# EAGLE design SSD1306 (EAGLE 9.6.2)
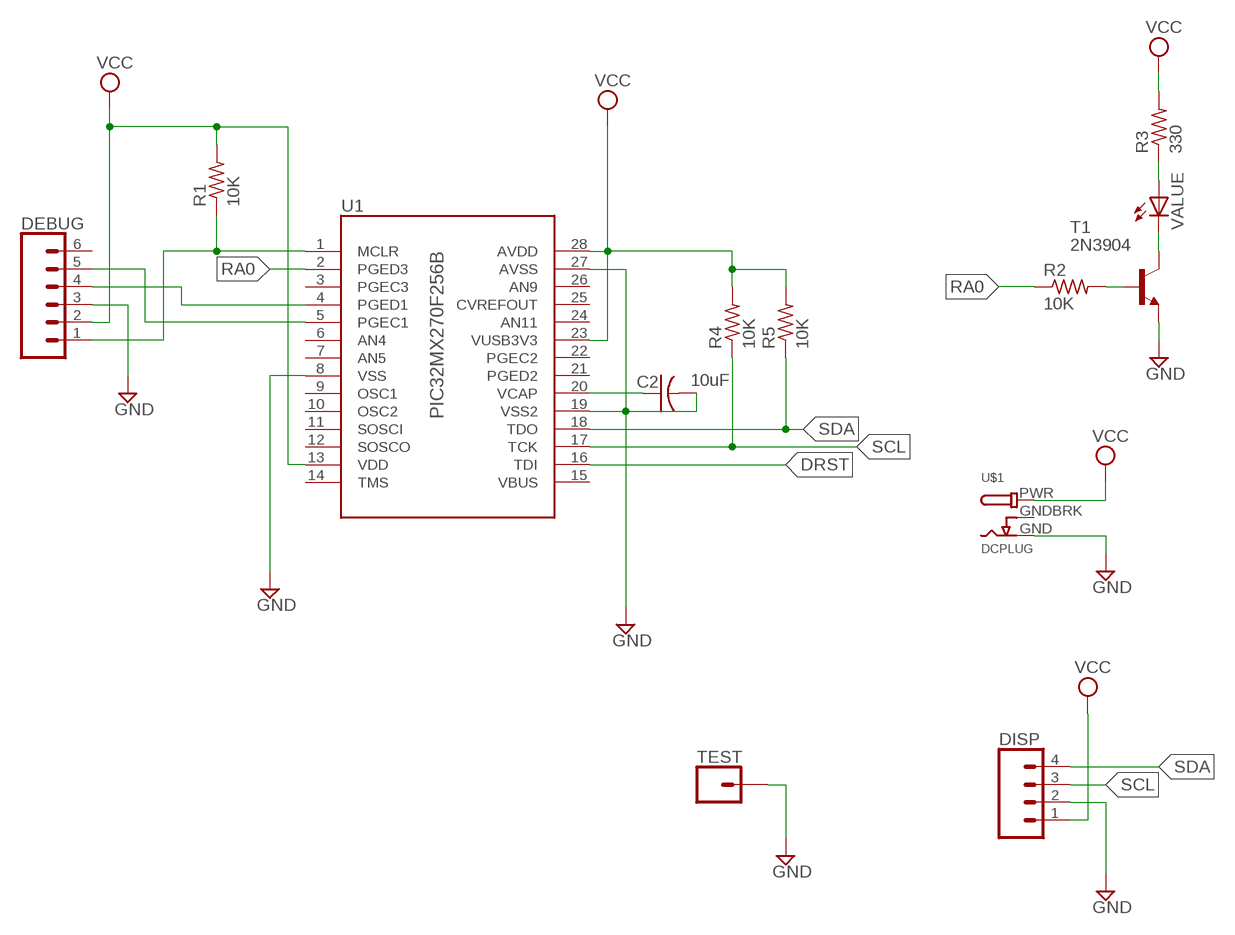
[diagram p0: schematic, sheet 1]

## Parts
C2  10uF  C-US050-024X044  [C050-024X044]
DEBUG  CONN_06LONGPADS  [1X06_LONGPADS]
DISP  CONN_04  [1X04]
R1  10K  R-US_0207/10  [0207/10]
R2  10K  R-US_0309/10  [0309/10]
R3  330  R-US_0309/10  [0309/10]
R4  10K  R-US_0207/10  [0207/10]
R5  10K  R-US_0207/10  [0207/10]
T1  2N3904  [TO92]
TEST  CONN_01  [1X01]
U1  PIC32MX270F256B  [DIP28]
U$1  DCPLUG  [POWER_JACK_SLOT]
VALUE  LED5MM  [LED5MM]

## Nets
DRST: U1.16(TDI)
GND: C2.2 DEBUG.3 DISP.2 T1.3(E) TEST.1 U1.8(VSS) U1.19(VSS2) U1.27(AVSS) U$1.GND
N$1: DEBUG.1 R1.1 U1.1(MCLR)
N$2: C2.1 U1.20(VCAP)
N$4: DEBUG.4 U1.4(PGED1)
N$5: DEBUG.5 U1.5(PGEC1)
N$6: R2.2 T1.2(B)
N$7: T1.1(C) VALUE.K(C)
N$8: R3.1 VALUE.A
RA0: R2.1 U1.2(PGED3)
SCL: DISP.3 R4.1 U1.17(TCK)
SDA: DISP.4 R5.1 U1.18(TDO)
VCC: DEBUG.2 DISP.1 R1.2 R3.2 R4.2 R5.2 U1.13(VDD) U1.23(VUSB3V3) U1.28(AVDD) U$1.PWR
Unconnected: DEBUG.6 U1.3(PGEC3) U1.6(AN4) U1.7(AN5) U1.9(OSC1) U1.10(OSC2) U1.11(SOSCI) U1.12(SOSCO) U1.14(TMS) U1.15(VBUS) U1.21(PGED2) U1.22(PGEC2) U1.24(AN11) U1.25(CVREFOUT) U1.26(AN9)

## Power pins joined to a net without a drawn wire
GNDBREAK: U$1.GNDBRK(GNDBREAK)

## Library data of the parts
C2 = adafruit:C-US: CAPACITOR, American symbol
DEBUG = SparkFun-Connectors:CONN_06: Multi connection point. Often used as Generic Header-pin footprint for 0.1 inch spaced/style header connections On any of the 0.1 inch spaced packages, you can populate with these: Break Away Headers - Straight <https://www.sparkfun.com/products/116> (PRT-00116) Break Away Male Headers - Right Angle <https://www.sparkfun.com/products/553> (PRT-00553) Female Headers <https://www.sparkfun.com/products/115> (PRT-00115) Break Away Headers - Machine Pin <https://www.sparkfun.com/products/117> (PRT-00117) Break Away Female Headers - Swiss Machine Pin <https://www.sparkfun.com/products/743> (PRT-00743) Arduino Stackable Header - 6 Pin <https://www.sparkfun.com/products/9280> (PRT-09280) For SCREWTERMINALS and SPRING TERMINALS visit here: Screw Terimnals on SparkFun.com <https://www.sparkfun.com/search/results?term=Screw+Terminals> (5mm/3.5mm/2.54mm spacing) This device is also useful as a general connection point to wire up your design to another part of your project. Our various solder wires solder well into these plated through hole pads. Hook-Up Wire - Assortment (Stranded, 22 AWG) <https://www.sparkfun.com/products/11375> (PRT-11375) Hook-Up Wire - Assortment (Solid Core, 22 AWG) <https://www.sparkfun.com/products/11367> (PRT-11367) View the entire wire category on our website here <https://www.sparkfun.com/categories/141>
DISP = SparkFun-Connectors:CONN_04: Multi connection point. Often used as Generic Header-pin footprint for 0.1 inch spaced/style header connections On any of the 0.1 inch spaced packages, you can populate with these: Break Away Headers - Straight <https://www.sparkfun.com/products/116> (PRT-00116) Break Away Male Headers - Right Angle <https://www.sparkfun.com/products/553> (PRT-00553) Female Headers <https://www.sparkfun.com/products/115> (PRT-00115) Break Away Headers - Machine Pin <https://www.sparkfun.com/products/117> (PRT-00117) Break Away Female Headers - Swiss Machine Pin <https://www.sparkfun.com/products/743> (PRT-00743) For SCREWTERMINALS and SPRING TERMINALS visit here: Screw Terimnals on SparkFun.com <https://www.sparkfun.com/search/results?term=Screw+Terminals> (5mm/3.5mm/2.54mm spacing) This device is also useful as a general connection point to wire up your design to another part of your project. Our various solder wires solder well into these plated through hole pads. Hook-Up Wire - Assortment (Stranded, 22 AWG) <https://www.sparkfun.com/products/11375> (PRT-11375) Hook-Up Wire - Assortment (Solid Core, 22 AWG) <https://www.sparkfun.com/products/11367> (PRT-11367) View the entire wire category on our website here <https://www.sparkfun.com/categories/141> Special notes: Molex polarized connector foot print use with SKU : PRT-08231 with associated crimp pins and housings. 1MM SMD Version SKU: PRT-10208; PROD_ID: CONN-09696
R1-R5 = resistor:R-US_: RESISTOR, American symbol
T1 = transistor:2N3904: NPN TRANSISTOR
TEST = SparkFun-Connectors:CONN_01: Single connection point. Often used as Generic Header-pin footprint for 0.1 inch spaced/style header connections On any of the 0.1 inch spaced packages, you can populate with these: Break Away Headers - Straight <https://www.sparkfun.com/products/116> (PRT-00116) Break Away Male Headers - Right Angle <https://www.sparkfun.com/products/553> (PRT-00553) Female Headers <https://www.sparkfun.com/products/115> (PRT-00115) Break Away Headers - Machine Pin <https://www.sparkfun.com/products/117> (PRT-00117) Break Away Female Headers - Swiss Machine Pin <https://www.sparkfun.com/products/743> (PRT-00743) This device is also useful as a general connection point to wire up your design to another part of your project. Our various solder wires solder well into these plated through hole pads. Hook-Up Wire - Assortment (Stranded, 22 AWG) <https://www.sparkfun.com/products/11375> (PRT-11375) Hook-Up Wire - Assortment (Solid Core, 22 AWG) <https://www.sparkfun.com/products/11367> (PRT-11367) View the entire wire category on our website here <https://www.sparkfun.com/categories/141> Special notes: SMTSO-256-ET is a "flush mount" nut for a 4-40 screw. We mostly use this on specialty testbeds; it is a nice way to connect hardware to your PCB at an adjustable hieght. Also note, the SNAP packages are for using a snappable style connector. We sell a baggie of snaps and they are also used on two LilyPad designs: Snap Assortment - 30 pack (male and female) <https://www.sparkfun.com/products/11347> (DEV-11347) LilyPad Arduino SimpleSnap <https://www.sparkfun.com/products/10941> (DEV-10941) LilyPad SimpleSnap Protoboard <https://www.sparkfun.com/products/10940> (DEV-10940)
U1 = my_parts:PIC32MX270F256B
U$1 = my_parts:DCPLUG
VALUE = led:LED: LED OSRAM: - CHIPLED LG R971, LG N971, LY N971, LG Q971, LY Q971, LO R971, LY R971 LH N974, LH R974 LS Q976, LO Q976, LY Q976 LO Q996 - Hyper CHIPLED LW Q18S LB Q993, LB Q99A, LB R99A - SideLED LS A670, LO A670, LY A670, LG A670, LP A670 LB A673, LV A673, LT A673, LW A673 LH A674 LY A675 LS A676, LA A676, LO A676, LY A676, LW A676 LS A679, LY A679, LG A679 - Hyper Micro SIDELED® LS Y876, LA Y876, LO Y876, LY Y876 LT Y87S - SmartLED LW L88C, LW L88S LB L89C, LB L89S, LG L890 LS L89K, LO L89K, LY L89K LS L896, LA L896, LO L896, LY L896 - TOPLED LS T670, LO T670, LY T670, LG T670, LP T670 LSG T670, LSP T670, LSY T670, LOP T670, LYG T670 LG T671, LOG T671, LSG T671 LB T673, LV T673, LT T673, LW T673 LH T674 LS T676, LA T676, LO T676, LY T676, LB T676, LH T676, LSB T676, LW T676 LB T67C, LV T67C, LT T67C, LS T67K, LO T67K, LY T67K, LW E67C LS E67B, LA E67B, LO E67B, LY E67B, LB E67C, LV E67C, LT E67C LW T67C LS T679, LY T679, LG T679 LS T770, LO T770, LY T770, LG T770, LP T770 LB T773, LV T773, LT T773, LW T773 LH T774 LS E675, LA E675, LY E675, LS T675 LS T776, LA T776, LO T776, LY T776, LB T776 LHGB T686 LT T68C, LB T68C - Hyper Mini TOPLED® LB M676 - Mini TOPLED Santana® LG M470 LS M47K, LO M47K, LY M47K Source: http://www.osram.convergy.de LUXEON: - LUMILED® LXK2-PW12-R00, LXK2-PW12-S00, LXK2-PW14-U00, LXK2-PW14-V00 LXK2-PM12-R00, LXK2-PM12-S00, LXK2-PM14-U00 LXK2-PE12-Q00, LXK2-PE12-R00, LXK2-PE12-S00, LXK2-PE14-T00, LXK2-PE14-U00 LXK2-PB12-K00, LXK2-PB12-L00, LXK2-PB12-M00, LXK2-PB14-N00, LXK2-PB14-P00, LXK2-PB14-Q00 LXK2-PR12-L00, LXK2-PR12-M00, LXK2-PR14-Q00, LXK2-PR14-R00 LXK2-PD12-Q00, LXK2-PD12-R00, LXK2-PD12-S00 LXK2-PH12-R00, LXK2-PH12-S00 LXK2-PL12-P00, LXK2-PL12-Q00, LXK2-PL12-R00 Source: www.luxeon.com KINGBRIGHT: KA-3528ASYC Source: www.kingbright.com

## Board
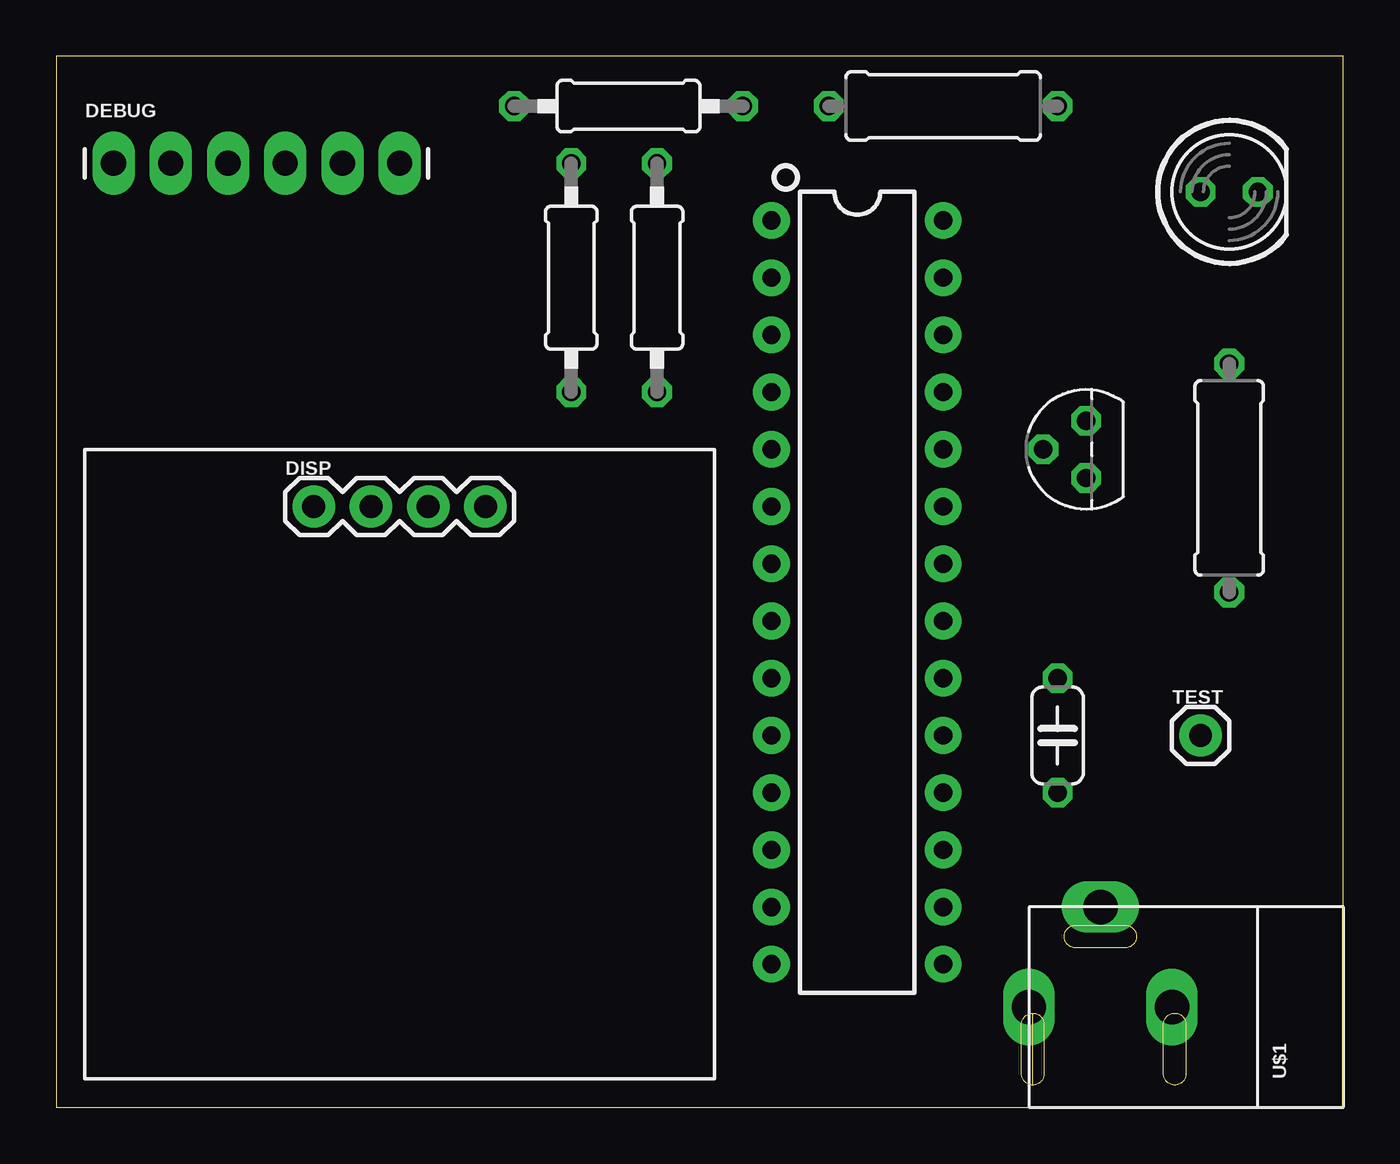
[diagram p1: board, top side]
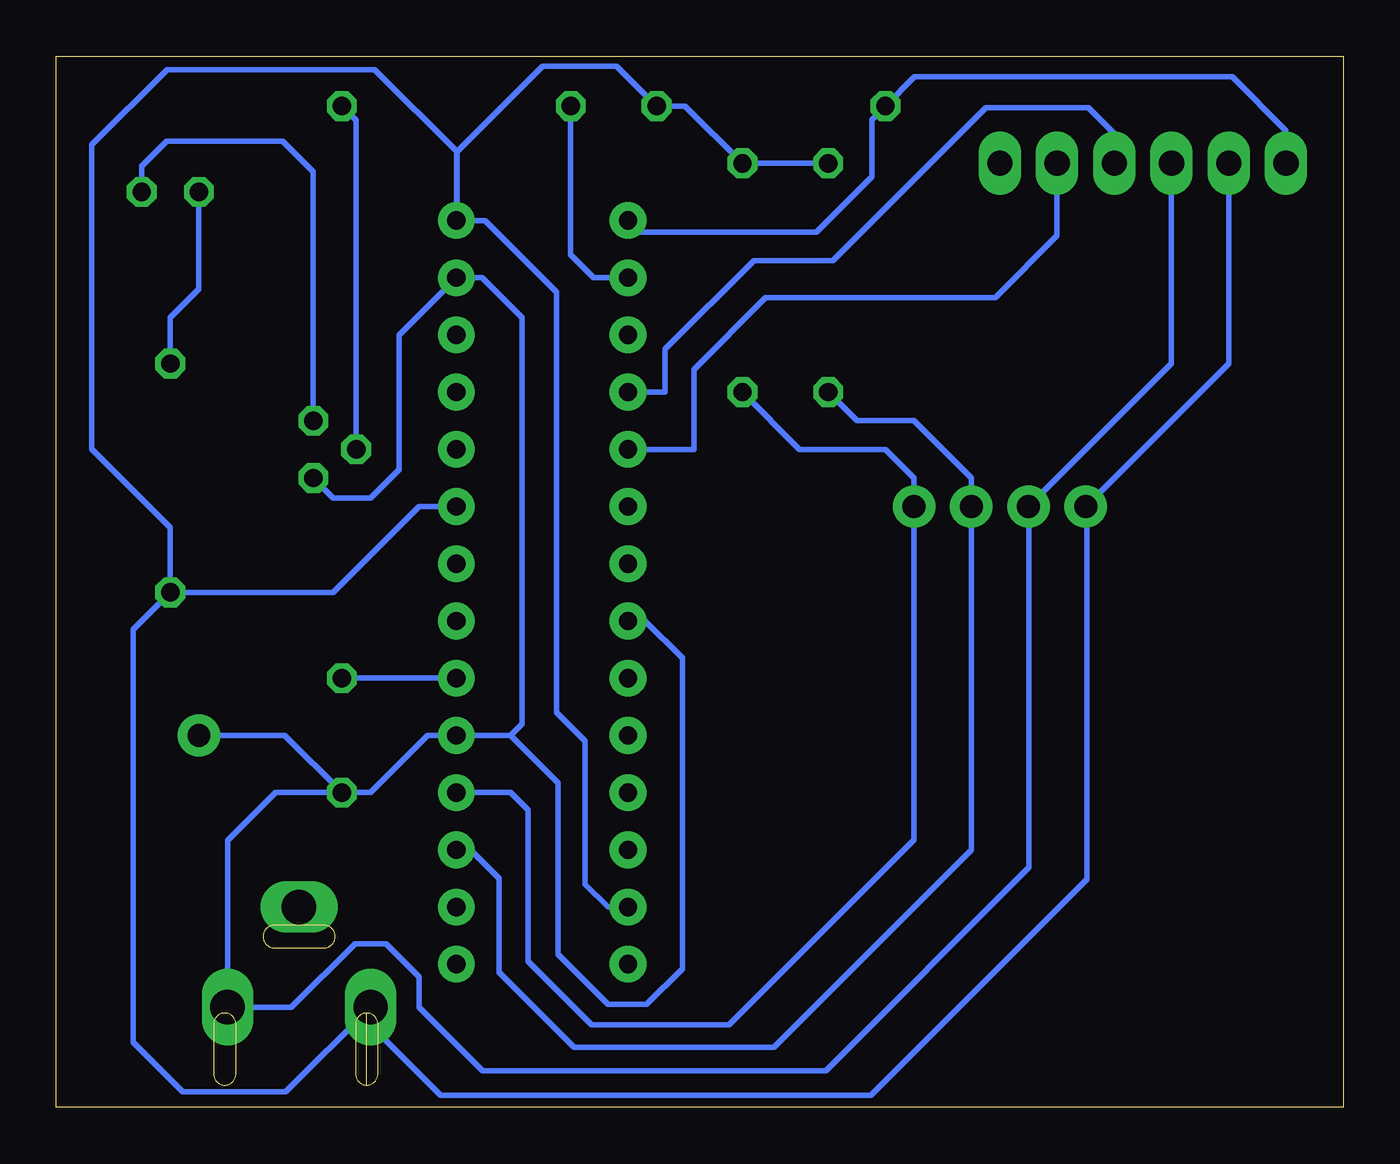
[diagram p2: board, bottom side, seen from below]

Size 57.13 x 46.66 mm. Coordinates in mm from the lower left corner, seen from the top.
Outline: 0,0 57.13,0 57.13,46.66 0,46.66 0,0
Copper layers (1*16): Top 0.035mm / dielectric 1.5mm / Bottom 0.035mm
Design rules "MyRules *": minimum track width 10mil, minimum drill 0.8mm, track to track 18mil, track to pad 18mil, pad to pad 18mil, via to via 18mil, smd to smd 0mil, copper to edge 0mil, drill to drill 6mil, minimum pad ring 10mil, minimum via ring 10mil, stop-mask expansion 1mil, vias tented up to drill 30mil, thermal gap 6mil

### Footprints (pad centres in the part's own frame; a part is rotated, then mirrored left to right if it is on the bottom)
C050-024X044 = drill 0.813 octagon: 1 -2.54,0; 2 2.54,0
1X06_LONGPADS = drill 1.118 pad 1.88 long: 1 0,0; 2 2.54,0; 3 5.08,0; 4 7.62,0; 5 10.16,0; 6 12.7,0
1X04 = drill 1.016 pad 1.88: 1 0,0; 2 2.54,0; 3 5.08,0; 4 7.62,0
0207/10 = drill 0.813 octagon: 1 -5.08,0; 2 5.08,0
0309/10 = drill 0.813 octagon: 1 -5.08,0; 2 5.08,0
TO92 = drill 0.813 octagon: 1 1.27,0; 2 0,1.905; 3 -1.27,0
1X01 = drill 1.016 pad 1.88: 1 0,0
DIP28 = drill 0.813 pad 1.626: 1 -16.51,-3.81; 2 -13.97,-3.81; 3 -11.43,-3.81; 4 -8.89,-3.81; 5 -6.35,-3.81; 6 -3.81,-3.81; 7 -1.27,-3.81; 8 1.27,-3.81; 9 3.81,-3.81; 10 6.35,-3.81; 11 8.89,-3.81; 12 11.43,-3.81; 13 13.97,-3.81; 14 16.51,-3.81; 15 16.51,3.81; 16 13.97,3.81; 17 11.43,3.81; 18 8.89,3.81; 19 6.35,3.81; 20 3.81,3.81; 21 1.27,3.81; 22 -1.27,3.81; 23 -3.81,3.81; 24 -6.35,3.81; 25 -8.89,3.81; 26 -11.43,3.81; 27 -13.97,3.81; 28 -16.51,3.81
POWER_JACK_SLOT = drill 1.524 pad 2 long: GND 4.445,7.62; GNDBRK 8.89,10.795; PWR 4.445,13.97
LED5MM = drill 0.813 octagon: A -1.27,0; K 1.27,0

### Placement (x,y rotation side)
C2  44.45,16.51 270 top
DEBUG  2.54,41.91 0 top
DISP  11.43,26.67 0 top
R1  25.4,44.45 0 top
R2  39.37,44.45 0 top
R3  52.07,27.94 270 top
R4  22.86,36.83 90 top
R5  26.67,36.83 90 top
T1  45.72,29.21 90 top
TEST  50.8,16.51 0 top
U1  35.56,22.86 270 top
U$1  57.15,0 90 top
VALUE  52.07,40.64 0 top

### Tracks (layer width: path | path; a pad name or v marks a point on that pad's centre or on a via)
GND
  Bottom 0.254: U1.19 40.64,16.51 43.18,13.97 C2.2 | DEBUG.3 7.62,33.02 DISP.2 13.95,26.64 13.95,10.65 22.97,1.63 38.2,1.63 41.02,4.45 41.02,5.8 42.49,7.26 43.87,7.26 46.69,4.45 U$1.GND 49.53,11.84 47.4,13.97 C2.2 | C2.2 46.99,16.51 TEST.1 | T1.3 44.83,27.05 43.18,27.05 41.91,28.32 41.91,34.29 U1.27 38.23,36.83 36.45,35.05 36.45,17.02 36.96,16.51 U1.19 | U1.19 36.96,16.51 34.85,14.4 34.85,6.78 32.64,4.57 30.92,4.57 29.34,6.15 29.34,19.94 30.99,21.59 U1.8
N$1
  Bottom 0.254: DEBUG.1 2.54,43.35 4.93,45.74 19.02,45.74 R1.1 20.93,43.84 20.93,41.32 23.39,38.86 31.24,38.86 U1.1
N$2
  Bottom 0.254: C2.1 U1.20
N$4
  Bottom 0.254: DEBUG.4 10.16,43.23 11.31,44.37 15.87,44.37 22.65,37.59 26.16,37.59 30.1,33.66 30.1,31.75 U1.4
N$5
  Bottom 0.254: U1.5 28.83,29.21 28.83,32.75 25.64,35.94 15.45,35.94 12.7,38.69 DEBUG.5
N$6
  Bottom 0.254: R2.2 43.81,43.81 T1.2
N$7
  Bottom 0.254: T1.1 45.72,41.53 47.09,42.9 52.22,42.9 53.34,41.78 VALUE.K
N$8
  Bottom 0.254: VALUE.A 50.8,36.32 52.07,35.05 R3.1
RA0
  Bottom 0.254: U1.2 33.27,36.83 34.29,37.85 R2.1
SCL
  Bottom 0.254: U1.17 38.73,11.43 37.47,10.16 37.47,5.99 34.14,2.67 25.27,2.67 16.51,11.43 DISP.3 16.51,27.94 19.05,30.48 21.59,30.48 R4.1
SDA
  Bottom 0.254: U1.18 36.96,13.97 36.2,13.21 36.2,6.49 33.36,3.66 27.27,3.66 19.05,11.88 DISP.4 19.05,27.94 20.32,29.21 24.13,29.21 R5.1
VCC
  Bottom 0.254: DEBUG.2 5.08,33.02 DISP.1 11.38,26.62 11.38,10.12 20.97,0.53 40.08,0.53 43.18,3.64 U$1.PWR 46.94,0.69 51.52,0.69 53.72,2.89 53.72,21.21 R3.2 | R4.2 R5.2 29.21,44.45 R1.2 32.26,46.23 35.54,46.23 39.37,42.4 U1.28 | U1.28 38.1,39.37 34.92,36.2 34.92,17.53 33.66,16.26 33.66,9.91 32.64,8.89 U1.13 | U1.23 41.02,26.67 44.83,22.86 R3.2 | U1.28 39.34,39.4 39.34,42.43 42.99,46.08 52.2,46.08 55.55,42.73 55.55,29.22 52.07,25.74 R3.2